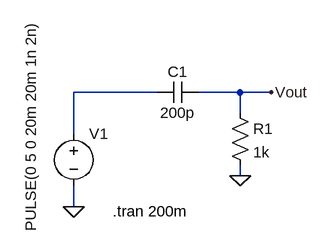
[diagram p0: schematic triangle_to_square_diff.asc]
triangle_to_square_diff.asc, the LTspice schematic file:
Version 4
SHEET 1 880 680
WIRE 160 80 32 80
WIRE 288 80 224 80
WIRE 336 80 288 80
WIRE 288 112 288 80
WIRE 32 144 32 80
WIRE 288 208 288 192
WIRE 32 256 32 224
FLAG 32 256 0
FLAG 288 208 0
FLAG 336 80 Vout
SYMBOL cap 224 64 R90
WINDOW 0 0 32 VBottom 2
WINDOW 3 32 32 VTop 2
SYMATTR InstName C1
SYMATTR Value 200p
SYMBOL voltage 32 128 R0
WINDOW 3 -66 -158 VRight 2
WINDOW 123 0 0 Left 0
WINDOW 39 0 0 Left 0
SYMATTR InstName V1
SYMATTR Value PULSE(0 5 0 20m 20m 1n 2n)
SYMBOL res 272 96 R0
SYMATTR InstName R1
SYMATTR Value 1k
TEXT 208 263 Right 2 !.tran 200m

The netlist it stands for:
* triangle_to_square_diff.asc
C1 Vout N001 200p
V1 N001 0 PULSE(0 5 0 20m 20m 1n 2n)
R1 Vout 0 1k
.tran 200m
.backanno
.end